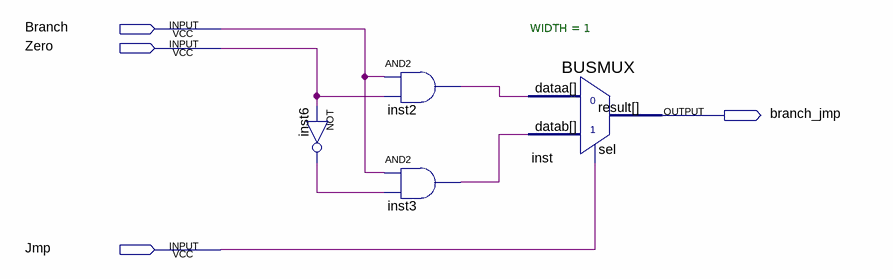
[diagram p0: schematic sheet]
// Quartus schematic branch.bdf as structural Verilog: 4 symbols, 4 pins
module branch (
  input  Branch,
  input  Zero,
  input  Jmp,
  output branch_jmp
);

  wire inst2_out, inst3_out, inst6_out;

  not inst6 (inst6_out, Zero);
  and inst2 (inst2_out, Branch, Zero);
  and inst3 (inst3_out, Branch, inst6_out);
  BUSMUX #(.WIDTH(1)) inst (.datab(inst3_out), .sel(Jmp), .dataa(inst2_out), .result(branch_jmp));
endmodule
